# Altium schematic sheet POWER.SchDoc
size A3; SheetNumber: 10; SheetTotal: 20
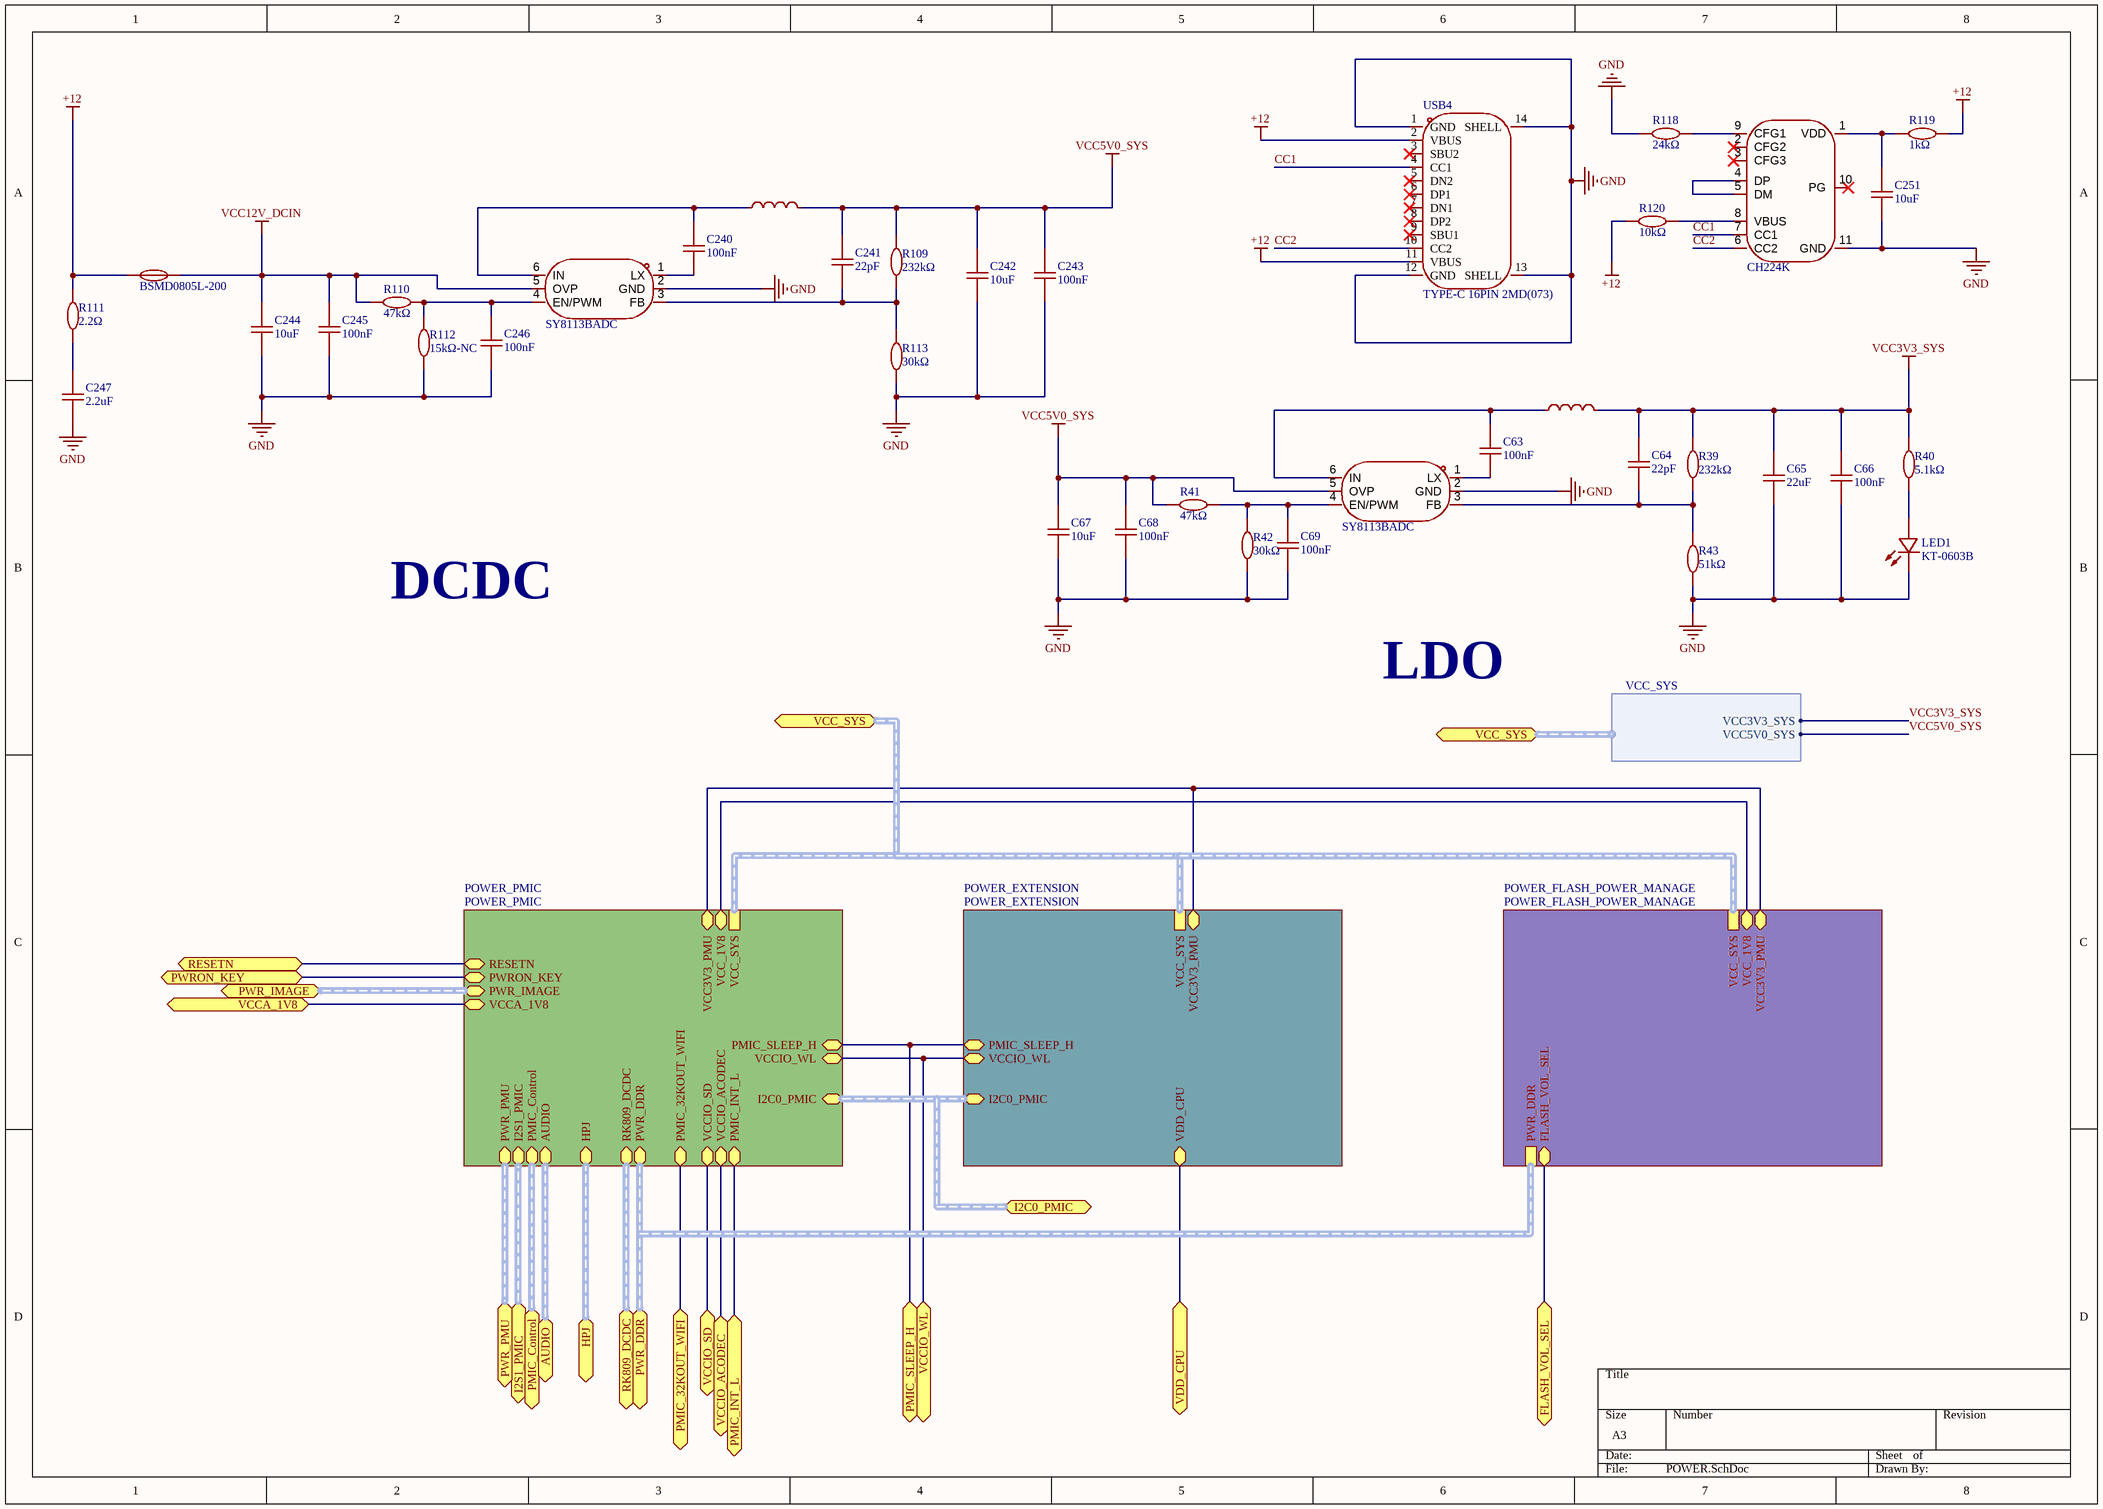
[diagram p0: POWER.SchDoc]

## Parts
C63  100nF  [C0402]
C64  22pF  [C0402]
C65  22uF  [C0603]
C66  100nF  [C0402]
C67  10uF  [C0603]
C68  100nF  [C0402]
C69  100nF  [C0402]
C240  100nF  [C0402]
C241  22pF  [C0402]
C242  10uF  [C0603]
C243  100nF  [C0402]
C244  10uF  [C0603]
C245  100nF  [C0402]
C246  100nF  [C0402]
C247  2.2uF  [C0402]
C251  10uF  [C0603]
F2  BSMD0805L-200  [F0805]
L2  3.3uH  [IND-SMD_L4.4-W4.2]  (value not drawn)
L11  6.8uH  [IND-SMD_L4.4-W4.2]  (value not drawn)
LED1  KT-0603B  [LED0603-BL]
R39  232kΩ  [R0402]
R40  5.1kΩ  [R0402]
R41  47kΩ  [R0402]
R42  30kΩ  [R0402]
R43  51kΩ  [R0402]
R109  232kΩ  [R0402]
R110  47kΩ  [R0402]
R111  2.2Ω  [R0402]
R112  15kΩ-NC  [R0402]
R113  30kΩ  [R0402]
R118  24kΩ  [R0402]
R119  1kΩ  [R0402]
R120  10kΩ  [R0402]
U19  SY8113BADC  [SOT-23-6_L2.9-W1.6-P0.95-LS2.8-BR]
U22  CH224K  [ESSOP-10_L4.9-W3.9-P1.0-LS6.0-TL-EP]
U41  SY8113BADC  [SOT-23-6_L2.9-W1.6-P0.95-LS2.8-BR]
USB4  TYPE-C 16PIN 2MD(073)  [USB-C-SMD_TYPE-C-6PIN-2MD-073]

## Sub-sheets
POWER_EXTENSION = POWER_EXTENSION: VCCIO_WL (bidir), I2C0_PMIC (bidir), PMIC_SLEEP_H (bidir), VCC3V3_PMU (bidir), VDD_CPU (bidir), VCC_SYS (harness VCC_SYS)
POWER_FLASH_POWER_MANAGE = POWER_FLASH_POWER_MANAGE: VCC3V3_PMU (bidir), FLASH_VOL_SEL (bidir), VCC_1V8 (bidir), PWR_DDR, VCC_SYS
POWER_PMIC = POWER_PMIC: VCCIO_WL (bidir), I2C0_PMIC (bidir), I2S1_PMIC (bidir), PMIC_Control (bidir), AUDIO (bidir), PMIC_SLEEP_H (bidir), RK809_DCDC (bidir), PMIC_32KOUT_WIFI (bidir), HPJ (bidir), PWR_DDR (bidir), VCCIO_SD (bidir), VCCIO_ACODEC (bidir), PWR_IMAGE (bidir), PWR_PMU (bidir), VCC3V3_PMU (bidir), PMIC_INT_L (bidir), VCC_1V8 (bidir), PWRON_KEY (bidir), RESETN (bidir), VCC_SYS (harness VCC_SYS), VCCA_1V8 (bidir)

## Ports
AUDIO (bidir, harness PMIC_Control, see Overview[4A], Audio_AND_HPJ[1A], POWER_PMIC[2D]), FLASH_VOL_SEL (bidir, see Overview[5B], POWER_FLASH_POWER_MANAGE[3A], RK3566[3D], RK3566_OSC_PLL_PMUO1_2[2B]), HPJ (bidir, harness HPJ, see Overview[4A], Audio_AND_HPJ[3C], POWER_PMIC[6D]), I2C0_PMIC (bidir, see Overview[4B], POWER_EXTENSION[4A], POWER_PMIC[1A], RK3566[3D], RK3566_OSC_PLL_PMUO1_2[5A]), I2S1_PMIC (bidir, harness I2S1_PMIC, see Overview[4B], POWER_PMIC[3A], RK3566[3B], RK3566_FLASH_SD_SARADC[6C]), PMIC_32KOUT_WIFI (bidir, see Overview[5A], POWER_PMIC[7A], Wi-Fi_BT[6C]), PMIC_Control (bidir, harness PMIC_Control, see Overview[4B], POWER_PMIC[4A], RK3566[3D], RK3566_OSC_PLL_PMUO1_2[1A]), PMIC_INT_L (bidir, see Overview[5B], POWER_PMIC[7A], RK3566[3D], RK3566_OSC_PLL_PMUO1_2[2B]), PMIC_SLEEP_H (bidir, see Overview[5B], POWER_EXTENSION[1A], POWER_PMIC[7A], RK3566[3D], RK3566_OSC_PLL_PMUO1_2[2B]), PWR_DDR (bidir, harness RK809_DCDC, see Overview[4B], POWER_FLASH_POWER_MANAGE[3B], POWER_PMIC[2D], RK3566[2A], RK3566_DDR_PHY[1A]), PWR_IMAGE (bidir, harness PWR_IMAGE, see Overview[4B], POWER_PMIC[3B], RK3566[3C], RK3566_MIPI_HDMI[5D], RK3566_USB_GPIO[1B]), PWR_PMU (bidir, harness PWR_PMU, see Overview[5B], LPDDR4[4C], POWER_PMIC[4D], RK3566[3C], RK3566_OSC_PLL_PMUO1_2[1A]), PWRON_KEY (bidir, see Overview[4A], DEBUG_AND_GPIO[8B], POWER_PMIC[7A]), RESETN (bidir, see Overview[4A], DEBUG_AND_GPIO[8D], POWER_PMIC[7A], RK3566[3C], RK3566_OSC_PLL_PMUO1_2[2B]), RK809_DCDC (bidir, harness RK809_DCDC, see Overview[4B], POWER_PMIC[1A], RK3566[3D], RK3566_POWER[2A]), VCC_SYS (bidir, harness VCC_SYS, see Overview[4A], Audio_AND_HPJ[3A], DEBUG_AND_GPIO[1D], HDMI[2C], MIPI_DSI_TP[6A], POWER_EXTENSION[4D], POWER_FLASH_POWER_MANAGE[3C], POWER_PMIC[6D], Wi-Fi_BT[3D]), VCCA_1V8 (bidir, see Overview[4A], DEBUG_AND_GPIO[5C], POWER_PMIC[7A], RK3566[3C], RK3566_USB_GPIO[6C]), VCCIO_ACODEC (bidir, see Overview[4B], POWER_PMIC[1D], RK3566[3B], RK3566_FLASH_SD_SARADC[7C]), VCCIO_SD (bidir, see Overview[4B], POWER_PMIC[2D], RK3566[3B], RK3566_FLASH_SD_SARADC[7C]), VCCIO_WL (bidir, see Overview[4B], POWER_EXTENSION[1A], POWER_PMIC[1D], POWER_PMIC[4A], RK3566[3B], RK3566_FLASH_SD_SARADC[7C]), VDD_CPU (bidir, see Overview[5B], POWER_EXTENSION[1A], RK3566[3D], RK3566_POWER[3A])

## Harnesses
VCC_SYS: VCC3V3_SYS, VCC5V0_SYS

## Nets
+12: F2.1 R111.2 R119.2 R120.1 USB4.2(VBUS) USB4.11(VBUS)
GND: C65.1 C66.1 C67.1 C68.1 C69.1 C242.1 C243.1 C244.1 C245.1 C246.1 C247.1 C251.1 LED1.1(K) R42.1 R43.1 R112.1 R113.1 R118.1 U19.2(GND) U22.11(GND) U41.2(GND) USB4.1(GND) USB4.12(GND) USB4.13(SHELL) USB4.14(SHELL)
VCC3V3_SYS: C64.2 C65.2 C66.2 L2.2 R39.2 R40.2 ; port VCC_SYS.VCC3V3_SYS
VCC5V0_SYS: C67.2 C68.2 C241.2 C242.2 C243.2 L11.2 R41.1 R109.2 U19.5(OVP) ; port VCC_SYS.VCC5V0_SYS
VCC12V_DCIN: C244.2 C245.2 F2.2 R110.1 U41.5(OVP)
CC1: U22.7(CC1) USB4.4(CC1)
CC2: U22.6(CC2) USB4.10(CC2)
FLASH_VOL_SEL: port FLASH_VOL_SEL, sheet POWER_FLASH_POWER_MANAGE/FLASH_VOL_SEL
PMIC_32KOUT_WIFI: port PMIC_32KOUT_WIFI, sheet POWER_PMIC/PMIC_32KOUT_WIFI
PMIC_INT_L: port PMIC_INT_L, sheet POWER_PMIC/PMIC_INT_L
PMIC_SLEEP_H: port PMIC_SLEEP_H, sheet POWER_PMIC/PMIC_SLEEP_H, sheet POWER_EXTENSION/PMIC_SLEEP_H
PWRON_KEY: port PWRON_KEY, sheet POWER_PMIC/PWRON_KEY
RESETN: port RESETN, sheet POWER_PMIC/RESETN
VCCA_1V8: port VCCA_1V8, sheet POWER_PMIC/VCCA_1V8
VCCIO_ACODEC: port VCCIO_ACODEC, sheet POWER_PMIC/VCCIO_ACODEC
VCCIO_SD: port VCCIO_SD, sheet POWER_PMIC/VCCIO_SD
VCCIO_WL: port VCCIO_WL, sheet POWER_PMIC/VCCIO_WL, sheet POWER_EXTENSION/VCCIO_WL
VDD_CPU: port VDD_CPU, sheet POWER_EXTENSION/VDD_CPU
NetC63_1: C63.1 U19.1(LX)
NetC63_2: C63.2 L2.1 U19.6(IN)
NetC64_1: C64.1 R39.1 R43.2 U19.3(FB)
NetC69_2: C69.2 R41.2 R42.2 U19.4(EN/PWM)
NetC240_1: C240.1 U41.1(LX)
NetC240_2: C240.2 L11.1 U41.6(IN)
NetC241_1: C241.1 R109.1 R113.2 U41.3(FB)
NetC246_2: C246.2 R110.2 R112.2 U41.4(EN/PWM)
NetC247_2: C247.2 R111.1
NetC251_2: C251.2 R119.1 U22.1(VDD)
NetLED1_2: LED1.2(A) R40.1
NetR118_2: R118.2 U22.9(CFG1)
NetR120_2: R120.2 U22.8(VBUS)
NetU22_4: U22.4(DP) U22.5(DM)
(unnamed): sheet POWER_PMIC/VCC3V3_PMU, sheet POWER_EXTENSION/VCC3V3_PMU, sheet POWER_FLASH_POWER_MANAGE/VCC3V3_PMU
(unnamed): sheet POWER_PMIC/VCC_1V8, sheet POWER_FLASH_POWER_MANAGE/VCC_1V8

Not connected (* = marked no-connect by the designer): U22 2(CFG2)* 3(CFG3)* 10(PG)*; USB4 3(SBU2)* 5(DN2)* 6(DP1)* 7(DN1)* 8(DP2)* 9(SBU1)*

## Buses and harness runs
harness port AUDIO = sheet POWER_PMIC/AUDIO
harness port HPJ = sheet POWER_PMIC/HPJ
harness port I2C0_PMIC = sheet POWER_EXTENSION/I2C0_PMIC = sheet POWER_PMIC/I2C0_PMIC
harness port I2S1_PMIC = sheet POWER_PMIC/I2S1_PMIC
harness port PMIC_Control = sheet POWER_PMIC/PMIC_Control
harness port PWR_DDR = sheet POWER_FLASH_POWER_MANAGE/PWR_DDR = sheet POWER_PMIC/PWR_DDR
harness port PWR_IMAGE = sheet POWER_PMIC/PWR_IMAGE
harness port PWR_PMU = sheet POWER_PMIC/PWR_PMU
harness port RK809_DCDC = sheet POWER_PMIC/RK809_DCDC
harness port VCC_SYS = sheet POWER_EXTENSION/VCC_SYS = sheet POWER_FLASH_POWER_MANAGE/VCC_SYS = sheet POWER_PMIC/VCC_SYS

## Notes on the sheet
- DCDC
- LDO

## Library data of the parts
C63 C66 C68 C69 C240 C243 C245 C246 = 100nF: 50V 100nF X7R ±10% 0402 Ceramic Capacitors ROHS
C64 C241 = 22pF: 50V 22pF C0G ±5% 0402 Ceramic Capacitors ROHS
C65 = 22uF: 16V 22uF X5R ±20% 0603 Ceramic Capacitors ROHS
C67 C242 C244 C251 = 10uF: 10V 10uF X5R ±10% 0603 Ceramic Capacitors ROHS
C247 = 2.2uF: 50V 2.2uF NP0 0402 Ceramic Capacitors ROHS
F2 = BSMD0805L-200: 6V 2A 0805自恢复; Symbol: BSMD0805L-200
L2 = MWSA0402S-3R3MT: SMD,4.4x4.2mm 特性：铁合金材料,高饱和电流,低DCR。闭合磁路设计,漏磁干扰小。无卤,符合RoHS标准。Metal material for large current and low DCR。Closed magnetic circuit design reduces leakage flux。Halogen free, RoHS compliant。应用：TV、显卡、内存。笔记本电脑、平板电脑; Manufacturer: Sunltech(顺磁); Symbol: SLW4030S1R0NST; Add into BOM: yes; Value: 1uH; Tolerance: ±30%; Current Rating: 4.15A; DC Resistance(DCR): 18mΩ; Device: SLW4030S1R0NST; LCSC Part Name: 1uH ±30%; Supplier Part: C206354; Manufacturer Part: SLW4030S1R0NST; Supplier Footprint: SMD,4x4mm; JLCPCB Part Class: Extended Part; Datasheet: https://item.szlcsc.com/datasheet/SLW4030S1R0NST/207399.html; Supplier: LCSC; Convert to PCB: yes
L11 = FXL0420-6R8-M: 6.8uH ±20% 2.5A SMD，4.4x4.2x1.8mm   合金电感，一体成型电感，大电流; Manufacturer: Sunltech(顺磁); Symbol: SLW4030S1R0NST; Add into BOM: yes; Value: 1uH; Tolerance: ±30%; Current Rating: 4.15A; DC Resistance(DCR): 18mΩ; Device: SLW4030S1R0NST; LCSC Part Name: 1uH ±30%; Supplier Part: C206354; Manufacturer Part: SLW4030S1R0NST; Supplier Footprint: SMD,4x4mm; JLCPCB Part Class: Extended Part; Datasheet: https://item.szlcsc.com/datasheet/SLW4030S1R0NST/207399.html; Supplier: LCSC; Convert to PCB: yes
LED1 = KT-0603B: 30mA 2.6V~3.2V Blue 0603 LED Indication - Discrete ROHS
R39 R109 = 232kΩ: 62.5mW 232kΩ 50V ±100ppm/℃ Thick Film Resistor ±1% 0402 Chip Resistor - Surface Mount ROHS
R40 = 5.1kΩ: 5.1kΩ 62.5mW 50V ±100ppm/℃ Thick Film Resistor ±1% 0402 Chip Resistor - Surface Mount ROHS
R41 R110 = 47kΩ: 62.5mW 47kΩ 50V ±100ppm/℃ Thick Film Resistor ±1% 0402 Chip Resistor - Surface Mount ROHS
R42 R112 R113 = 30kΩ: 62.5mW 30K 50V ±100ppm/℃ Thick Film Resistor ±1% 0402 Chip Resistor - Surface Mount ROHS
R43 = 51kΩ: 51kΩ 62.5mW 50V ±100ppm/℃ Thick Film Resistor ±1% 0402 Chip Resistor - Surface Mount ROHS
R111 = 2.2Ω: 小尺寸、重量轻。降低组装成本,与贴片机匹配。适用于波峰焊和回流焊
R118 = 24kΩ: 24kΩ 62.5mW 50V ±100ppm/℃ Thick Film Resistor ±1% 0402 Chip Resistor - Surface Mount ROHS
R119 = 1kΩ: 1kΩ 62.5mW 50V ±100ppm/℃ Thick Film Resistor ±1% 0402 Chip Resistor - Surface Mount ROHS
R120 = 10kΩ: 62.5mW 10kΩ 50V ±100ppm/℃ Thick Film Resistor ±1% 0402 Chip Resistor - Surface Mount ROHS
U19 U41 = SY8113BADC: 高效率500kHz 3A 18V输入同步降压转换器 SY8113B是一款高效率的500kHz同步降压DC-DC转换器,能够提供3A的输出电流。其输入电压范围为4.5V至18V,集成了主开关和同步开关,具有非常低的导通损耗。采用瞬时PWM架构,实现快速瞬态响应。低输出电压纹波和小型外部电感器和电容器尺寸通过500kHz开关频率实现。内部软启动限制了浪涌电流。; Symbol: SY7201ABC
U22 = CH224K: USBPD等多快充协议受电芯片CH224 ESSOP-10-150mil-1mm; Symbol: CH224K
USB4 = TYPE-C 16PIN 2MD(073): 16pin type-c